# Altium schematic sheet Sheet1.SchDoc
size A4
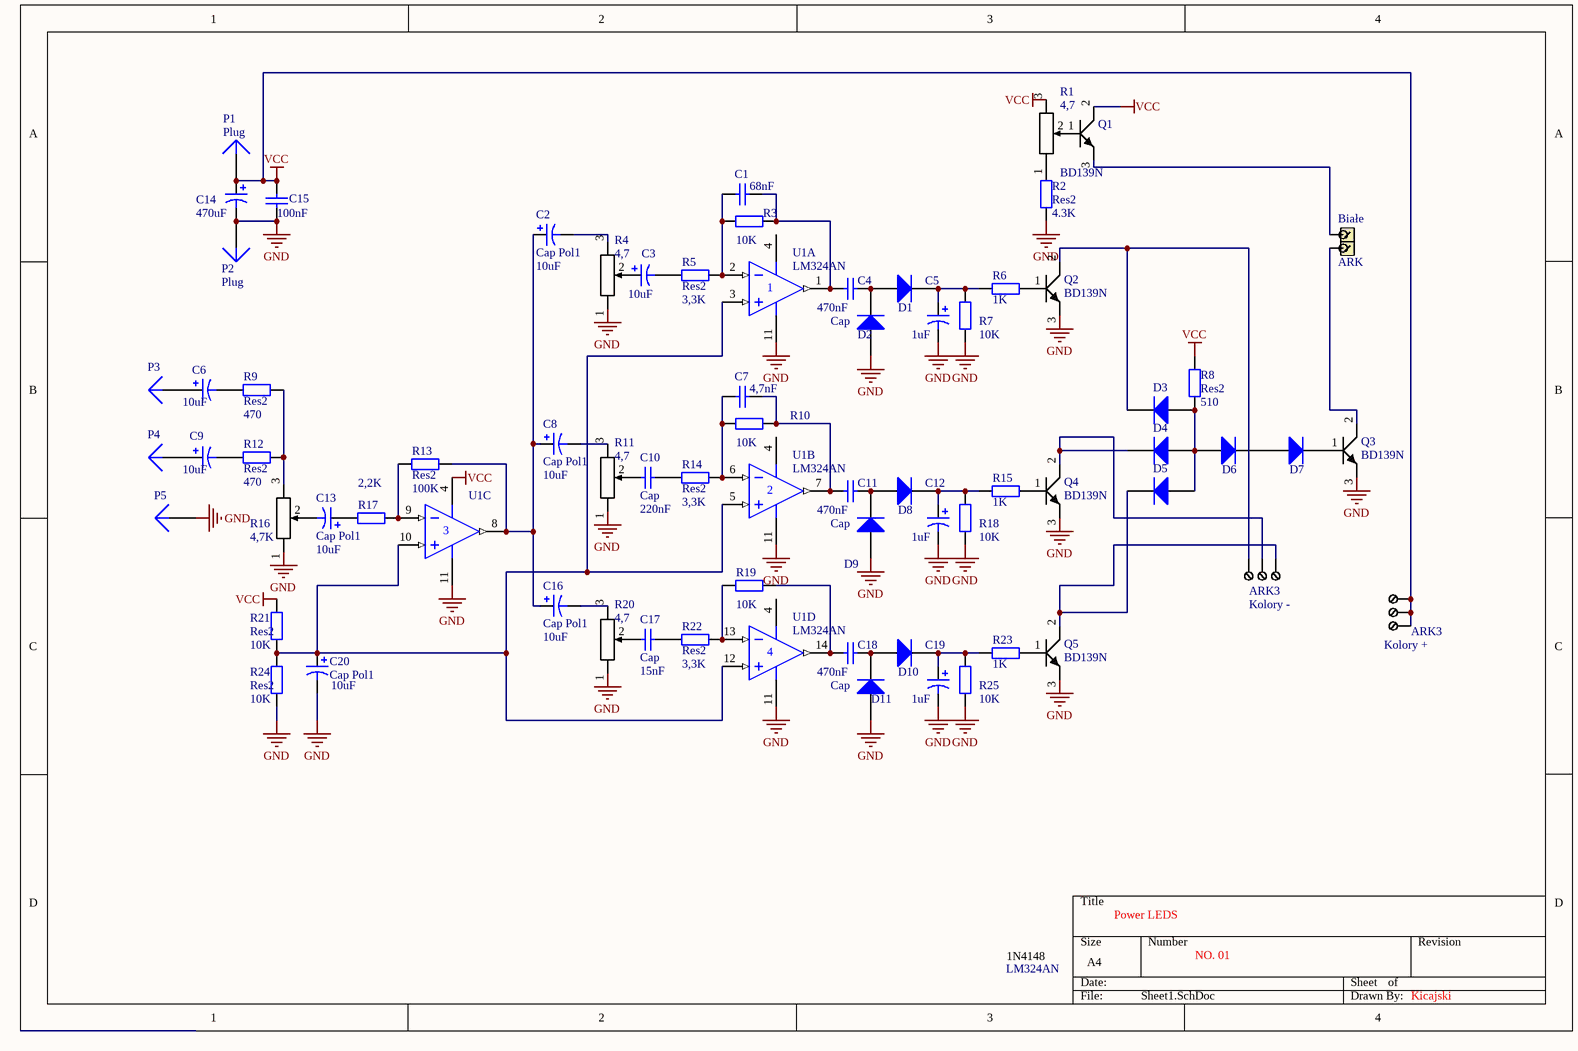
[diagram p0: Sheet1.SchDoc]

## Parts
Białe  ARK  [ARK2]
C1  value 68nF  [RAD-0.2]  (hidden comment: Cap)
C2  Cap Pol1  value 10uF  [CAPPR2.5-6.3x5]
C3  value 10uF  [CAPPR2.5-6.3x5]  (hidden comment: Cap Pol1)
C4  Cap  value 470nF  [RAD-0.2]
C5  value 1uF  [CAPPR2.5-6.3x5]  (hidden comment: Cap Pol1)
C6  value 10uF  [CAPPR2.5-6.3x5]  (hidden comment: Cap Pol1)
C7  value 4,7nF  [RAD-0.2]  (hidden comment: Cap)
C8  Cap Pol1  value 10uF  [CAPPR2.5-6.3x5]
C9  value 10uF  [CAPPR2.5-6.3x5]  (hidden comment: Cap Pol1)
C10  Cap  value 220nF  [RAD-0.2]
C11  Cap  value 470nF  [RAD-0.2]
C12  value 1uF  [CAPPR2.5-6.3x5]  (hidden comment: Cap Pol1)
C13  Cap Pol1  value 10uF  [CAPPR2.5-6.3x5]
C14  value 470uF  [CAPPR5-13x16]  (hidden comment: Cap Pol1)
C15  value 100nF  [RAD-0.3]  (hidden comment: Cap)
C16  Cap Pol1  value 10uF  [CAPPR2.5-6.3x5]
C17  Cap  value 15nF  [RAD-0.2]
C18  Cap  value 470nF  [RAD-0.2]
C19  value 1uF  [CAPPR2.5-6.3x5]  (hidden comment: Cap Pol1)
C20  Cap Pol1  value 10uF  [CAPPR2.5-6.3x5]
D1  Diode 1N4148  [DO-35]  (value not drawn)
D2  Diode 1N4148  [DO-35]  (value not drawn)
D3  Diode 1N4148  [DO-35]  (value not drawn)
D4  Diode 1N4148  [DO-35]  (value not drawn)
D5  Diode 1N4148  [DO-35]  (value not drawn)
D6  Diode 1N4148  [DO-35]  (value not drawn)
D7  Diode 1N4148  [DO-35]  (value not drawn)
D8  Diode 1N4148  [DO-35]  (value not drawn)
D9  Diode 1N4148  [DO-35]  (value not drawn)
D10  Diode 1N4148  [DO-35]  (value not drawn)
D11  Diode 1N4148  [DO-35]  (value not drawn)
Kolory_+  ARK3  [ARK3]
Kolory_-  ARK3  [ARK3]
P1  Plug  [PIN1]
P2  Plug  [PIN1]
P3  Plug  [PIN1]  (value not drawn)
P4  Plug  [PIN1]  (value not drawn)
P5  Plug  [PIN1]  (value not drawn)
Q1  BD139N  [BD139N]
Q2  BD139N  [BD139N]
Q3  BD139N  [BD139N]
Q4  BD139N  [BD139N]
Q5  BD139N  [BD139N]
R1  4,7  [Potencjometr]
R2  Res2  value 4.3K  [AXIAL-0.4]
R3  value 10K  [AXIAL-0.4]  (hidden comment: Res2)
R4  4,7  [Potencjometr]
R5  Res2  value 3,3K  [AXIAL-0.4]
R6  value 1K  [AXIAL-0.4]  (hidden comment: Res2)
R7  value 10K  [AXIAL-0.4]  (hidden comment: Res2)
R8  Res2  value 510  [AXIAL-0.4]
R9  Res2  value 470  [AXIAL-0.4]
R10  value 10K  [AXIAL-0.4]  (hidden comment: Res2)
R11  4,7  [Potencjometr]
R12  Res2  value 470  [AXIAL-0.4]
R13  Res2  value 100K  [AXIAL-0.4]
R14  Res2  value 3,3K  [AXIAL-0.4]
R15  value 1K  [AXIAL-0.4]  (hidden comment: Res2)
R16  4,7K  [Potencjometr]
R17  value 2,2K  [AXIAL-0.4]  (hidden comment: Res2)
R18  value 10K  [AXIAL-0.4]  (hidden comment: Res2)
R19  value 10K  [AXIAL-0.4]  (hidden comment: Res2)
R20  4,7  [Potencjometr]
R21  Res2  value 10K  [AXIAL-0.4]
R22  Res2  value 3,3K  [AXIAL-0.4]
R23  value 1K  [AXIAL-0.4]  (hidden comment: Res2)
R24  Res2  value 10K  [AXIAL-0.4]
R25  value 10K  [AXIAL-0.4]  (hidden comment: Res2)
U1  LM324AN  [N014]  (parts A,B,C,D of 4)

## Nets
GND: C5.2 C12.2 C14.2 C15.1 C19.2 C20.2 D2.1(A) D9.1(A) D11.1(A) P2.1 P5.1 Q2.3 Q3.3 Q4.3 Q5.3 R2.1 R4.1 R7.1 R11.1 R16.1 R18.1 R20.1 R24.1 R25.1 U1.11(V-)
VCC: C14.1 C15.2 Kolory_+.1 Kolory_+.2 Kolory_+.3 P1.1 Q1.2 R1.3 R8.2 R21.1 U1.4(V+)
NetBiałe_1: Białe.1 Q3.2
NetBiałe_2: Białe.2 Q1.3
NetC1_1: C1.1 R3.1 R5.2 U1.2(IN-)
NetC1_2: C1.2 C4.1 R3.2 U1.1(OUT)
NetC2_1: C2.1 C8.1 C16.1 R13.2 U1.8(OUT)
NetC2_2: C2.2 R4.3
NetC3_1: C3.1 R4.2
NetC3_2: C3.2 R5.1
NetC4_2: C4.2 D1.1(A) D2.2(K)
NetC5_1: C5.1 D1.2(K) R6.2 R7.2
NetC6_1: C6.1 P3.1
NetC6_2: C6.2 R9.1
NetC7_1: C7.1 R10.1 R14.2 U1.6(IN-)
NetC7_2: C7.2 C11.1 R10.2 U1.7(OUT)
NetC8_2: C8.2 R11.3
NetC9_1: C9.1 P4.1
NetC9_2: C9.2 R12.1
NetC10_1: C10.1 R11.2
NetC10_2: C10.2 R14.1
NetC11_2: C11.2 D8.1(A) D9.2(K)
NetC12_1: C12.1 D8.2(K) R15.2 R18.2
NetC13_1: C13.1 R17.1
NetC13_2: C13.2 R16.2
NetC16_2: C16.2 R20.3
NetC17_1: C17.1 R20.2
NetC17_2: C17.2 R22.1
NetC18_1: C18.1 R19.2 U1.14(OUT)
NetC18_2: C18.2 D10.1(A) D11.2(K)
NetC19_1: C19.1 D10.2(K) R23.2 R25.2
NetC20_1: C20.1 R21.2 R24.2 U1.3(IN+) U1.5(IN+) U1.10(IN+) U1.12(IN+)
NetD3_1: D3.1(A) D4.1(A) D5.1(A) D6.1(A) R8.1
NetD3_2: D3.2(K) Kolory_-.3 Q2.2
NetD4_2: D4.2(K) Kolory_-.2 Q4.2
NetD5_2: D5.2(K) Kolory_-.1 Q5.2
NetD6_2: D6.2(K) D7.1(A)
NetD7_2: D7.2(K) Q3.1
NetQ1_1: Q1.1 R1.2
NetQ2_1: Q2.1 R6.1
NetQ4_1: Q4.1 R15.1
NetQ5_1: Q5.1 R23.1
NetR1_1: R1.1 R2.2
NetR9_2: R9.2 R12.2 R16.3
NetR13_1: R13.1 R17.2 U1.9(IN-)
NetR19_1: R19.1 R22.2 U1.13(IN-)

## Notes on the sheet
- Power LEDS
- 1N4148
- NO. 01
- Kicajski

## Library data of the parts
C1 C4 C7 C10 C11 C15 C17 C18 = Cap: Capacitor; Published: 8-Jun-2000; LatestRevisionDate: 17-Jul-2002; LatestRevisionNote: Re-released for DXP Platform.; PackageReference: RAD-0.3; Publisher: Altium Limited; PackageDescription: Radial Cap, Thru-Hole; 2 Leads; 0.3 in Pin Spacing
C2 C3 C5 C6 C8 C9 C12-C14 C16 C19 C20 = Cap Pol1: Polarized Capacitor (Radial); Published: 8-Jun-2000; LatestRevisionDate: 17-Jul-2002; LatestRevisionNote: Re-released for DXP Platform.; PackageReference: RB7.6-15; Publisher: Altium Limited; PackageDescription: Polarized Capacitor (Radial); 2 Leads
D1-D11 = Diode 1N4148: High Conductance Fast Diode; Published: 8-Jun-2000; LatestRevisionDate: 17-Jul-2002; LatestRevisionNote: Re-released for DXP Platform.; DatasheetVersion: 1997; PackageReference: DO-35; Publisher: Altium Limited; PackageDescription: Diode, Axial; Body 3.8 x 1.9 mm (LxDia. max), Lead Dia. 0.53 mm (max); Code_JEDEC: DO-204-AH; ComponentLink1Description: Manufacturer Link; ComponentLink1URL: http://www.fairchildsemi.com/; ComponentLink2Description: Datasheet; ComponentLink2URL: http://www.fairchildsemi.com/ds/1N%2F1N4148.pdf
Kolory_- = ARK3: pin to pad: 1>2 2>1
R1 R4 R11 R16 R20 = Potencjometr
R2 R3 R5-R10 R12-R15 R17-R19 R21-R25 = Res2: Resistor; Published: 8-Jun-2000; LatestRevisionDate: 17-Jul-2002; LatestRevisionNote: Re-released for DXP Platform.; PackageReference: AXIAL-0.4; Publisher: Altium Limited; PackageDescription: Axial Device, Thru-Hole; 2 Leads; 0.4 in Pin Spacing
U1 = LM324AN: Quadruple Operational Amplifier; Published: 15-Apr-2002; LatestRevisionDate: 04-Mar-2005; LatestRevisionNote: Stylized 3D Model Added.; DatasheetVersion: Jan-1989; PackageVersion: Oct-1995; PackageReference: N014; Publisher: Altium Limited; PackageDescription: DIP; 14 Leads; Row Spacing 7.62 mm; Pitch 2.54 mm; ComponentLink1Description: Manufacturer Link; ComponentLink1URL: http://www.ti.com/; ComponentLink2Description: Datasheet; ComponentLink2URL: http://www-s.ti.com/sc/ds/lm324.pdf
P1-P5 = Plug: LatestRevisionDate: 17-Jul-2002; LatestRevisionNote: Re-released for DXP Platform.; Publisher: Altium Limited